# EAGLE design resistors_prototype (EAGLE 9.6.2)
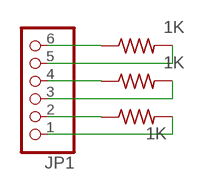
[diagram p0: schematic, sheet 1]

## Parts
JP1  PINHD-1X6  [1X06]
R2  1K  R-US_R0805  [R0805]
R4  1K  R-US_R0805  [R0805]
R5  1K  R-US_R0805  [R0805]

## Nets
N$1: JP1.6 R2.1
N$2: JP1.5 R2.2
N$3: JP1.4 R4.1
N$4: JP1.3 R4.2
N$5: JP1.2 R5.1
N$6: JP1.1 R5.2

## Library data of the parts
JP1 = pinhead:PINHD-1X6: PIN HEADER
R2 R4 R5 = adafruit:R-US_: RESISTOR, American symbol

## Board
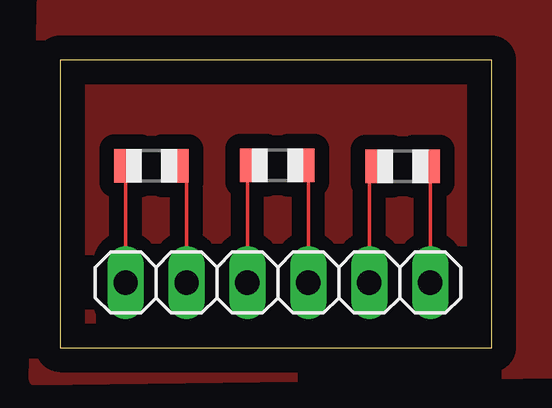
[diagram p1: board, top side]
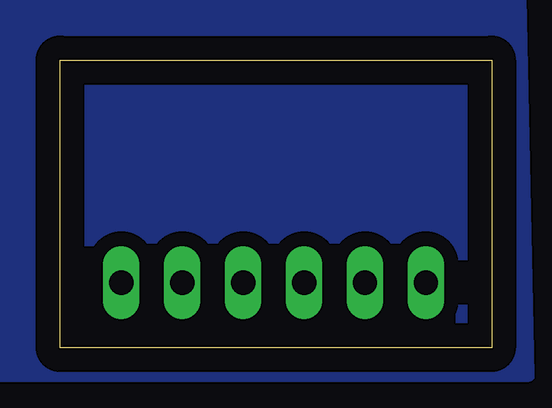
[diagram p2: board, bottom side, seen from below]

Size 18 x 12 mm. Coordinates in mm from the lower left corner, seen from the top.
Outline: 0,0 18,0 18,12 0,12 0,0
Copper layers (1*16): Top 0.035mm / dielectric 1.5mm / Bottom 0.035mm
Design rules "default": minimum track width 6mil, minimum drill 0.35mm, track to track 6mil, track to pad 6mil, pad to pad 6mil, via to via 6mil, smd to smd 6mil, copper to edge 40mil, drill to drill 6mil, minimum pad ring 10mil, minimum via ring 8mil, stop-mask expansion 4mil, vias tented up to drill 0mil, thermal gap 10mil

### Footprints (pad centres in the part's own frame; a part is rotated, then mirrored left to right if it is on the bottom)
1X06 = drill 1.016 long: 1 -6.35,0; 2 -3.81,0; 3 -1.27,0; 4 1.27,0; 5 3.81,0; 6 6.35,0
R0805 = smd 1.1 x 1.4: 1 -1,0; 2 1,0

### Placement (x,y rotation side)
JP1  9.09,2.71 0 top
R2  14.29,7.57 180 top
R4  9.07,7.6 180 top
R5  3.81,7.58 180 top

### Tracks (layer width: path | path; a pad name or v marks a point on that pad's centre or on a via)
GND
  pour Bottom (isolate 0.61): -1,24.5 24,24.5 23.58,-1.17 -1.56,-1.17
N$1
  Top 0.152: JP1.6 15.44,7.42 R2.1
N$2
  Top 0.152: JP1.5 12.9,7.18 R2.2
N$3
  Top 0.152: JP1.4 10.36,7.31 R4.1
N$4
  Top 0.152: JP1.3 7.82,7.35 R4.2
N$5
  Top 0.152: JP1.2 5.28,7.11 R5.1
N$6
  Top 0.152: JP1.1 2.74,7.51 R5.2
TOPSIGNAL
  pour Top (isolate 0.61): -0.5,24.5 24,24.5 24,-1 -1.05,-1.35